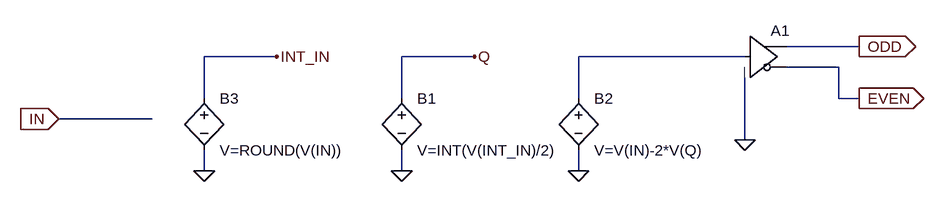
[diagram p0: schematic EvenOdd.asc]
EvenOdd.asc, the LTspice schematic file:
Version 4
SHEET 1 1100 680
WIRE 976 240 864 240
WIRE 80 256 -32 256
WIRE 384 256 272 256
WIRE 800 256 544 256
WIRE 944 272 864 272
WIRE -32 320 -32 256
WIRE 272 320 272 256
WIRE 544 320 544 256
WIRE 944 320 944 272
WIRE 976 320 944 320
WIRE -112 352 -256 352
WIRE 800 384 800 288
WIRE -32 432 -32 400
WIRE 272 432 272 400
WIRE 544 432 544 400
FLAG 272 432 0
FLAG -256 352 IN
IOPIN -256 352 In
FLAG 384 256 Q
FLAG 544 432 0
FLAG 976 240 ODD
IOPIN 976 240 Out
FLAG -32 432 0
FLAG 80 256 INT_IN
FLAG 976 320 EVEN
IOPIN 976 320 Out
FLAG 800 384 0
SYMBOL bv 272 304 R0
SYMATTR InstName B1
SYMATTR Value V=INT(V(INT_IN)/2)
SYMBOL bv 544 304 R0
SYMATTR InstName B2
SYMATTR Value V=V(IN)-2*V(Q)
SYMBOL bv -32 304 R0
SYMATTR InstName B3
SYMATTR Value V=ROUND(V(IN))
SYMBOL Digital\\buf 800 192 R0
SYMATTR InstName A1

The netlist it stands for:
* EvenOdd.asc
B1 Q 0 V=INT(V(INT_IN)/2)
B2 N001 0 V=V(IN)-2*V(Q)
B3 INT_IN 0 V=ROUND(V(IN))
A1 N001 0 0 0 0 EVEN ODD 0 BUF
.backanno
.end